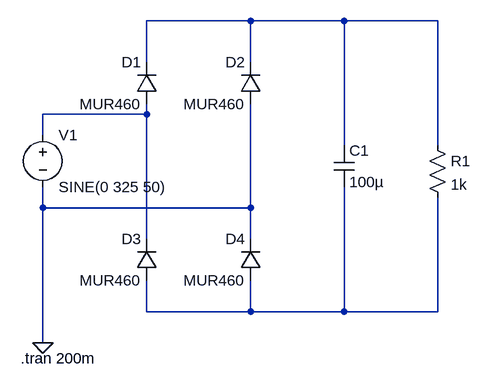
[diagram p0: schematic Draft1.asc]
Draft1.asc, the LTspice schematic file:
Version 4
SHEET 1 1032 680
WIRE 384 -64 224 -64
WIRE 528 -64 384 -64
WIRE 672 -64 528 -64
WIRE 224 0 224 -64
WIRE 384 0 384 -64
WIRE 224 80 224 64
WIRE 224 80 64 80
WIRE 64 112 64 80
WIRE 528 128 528 -64
WIRE 672 128 672 -64
WIRE 64 224 64 192
WIRE 384 224 384 64
WIRE 384 224 64 224
WIRE 224 272 224 80
WIRE 384 272 384 224
WIRE 224 384 224 336
WIRE 384 384 384 336
WIRE 384 384 224 384
WIRE 528 384 528 192
WIRE 528 384 384 384
WIRE 672 384 672 208
WIRE 672 384 528 384
WIRE 64 432 64 224
FLAG 64 432 0
SYMBOL voltage 64 96 R0
WINDOW 123 0 0 Left 0
WINDOW 39 0 0 Left 0
SYMATTR InstName V1
SYMATTR Value SINE(0 325 50)
SYMBOL diode 400 64 R180
WINDOW 0 24 64 Left 2
WINDOW 3 24 0 Left 2
SYMATTR InstName D2
SYMATTR Value MUR460
SYMBOL cap 512 128 R0
SYMATTR InstName C1
SYMATTR Value 100µ
SYMBOL res 656 112 R0
SYMATTR InstName R1
SYMATTR Value 1k
SYMBOL diode 240 64 R180
WINDOW 0 24 64 Left 2
WINDOW 3 24 0 Left 2
SYMATTR InstName D1
SYMATTR Value MUR460
SYMBOL diode 240 336 R180
WINDOW 0 24 64 Left 2
WINDOW 3 24 0 Left 2
SYMATTR InstName D3
SYMATTR Value MUR460
SYMBOL diode 400 336 R180
WINDOW 0 24 64 Left 2
WINDOW 3 24 0 Left 2
SYMATTR InstName D4
SYMATTR Value MUR460
TEXT 30 456 Left 2 !.tran 200m

The netlist it stands for:
* Draft1.asc
V1 N002 0 SINE(0 325 50)
D2 0 N001 MUR460
C1 N001 N003 100µ
R1 N001 N003 1k
D1 N002 N001 MUR460
D3 N003 N002 MUR460
D4 N003 0 MUR460
.model D D
.lib standard.dio
.tran 200m
.backanno
.end